# EAGLE design MOFO v1 (EAGLE 9.6.2)
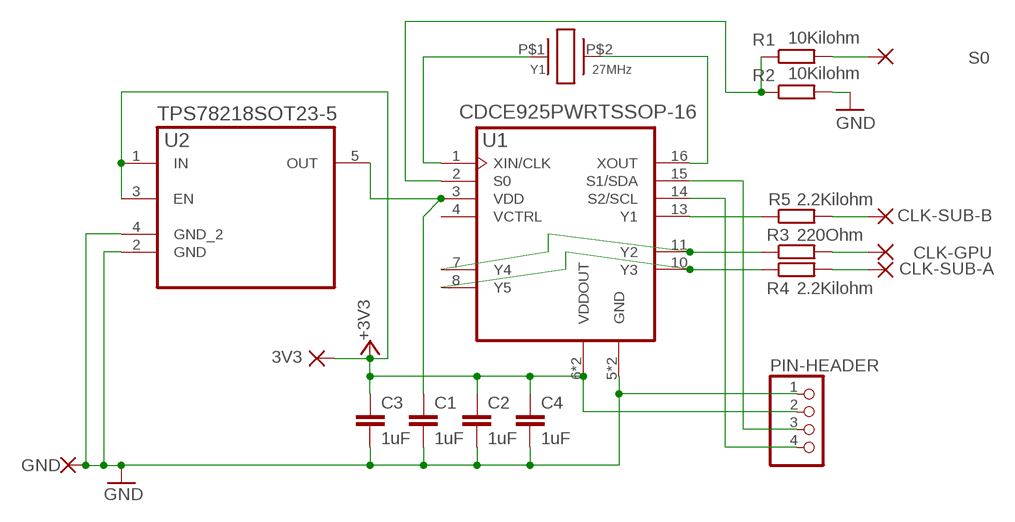
[diagram p0: schematic, sheet 1]

## Parts
3V3  PADSCIRCLE-1,5X1,5  [CIRCLE-1,5X1,5]
C1  1uF  CAPACITORSC0603  [C0603]
C2  1uF  CAPACITORSC0603  [C0603]
C3  1uF  CAPACITORSC0603  [C0603]
C4  1uF  CAPACITORSC0603  [C0603]
CLK-GPU  PADSCIRCLE-1,5X1,5  [CIRCLE-1,5X1,5]
CLK-SUB-A  PADSCIRCLE-1,5X1,5  [CIRCLE-1,5X1,5]
CLK-SUB-B  PADSCIRCLE-1,5X1,5  [CIRCLE-1,5X1,5]
GND  PADSCIRCLE-1,5X1,5  [CIRCLE-1,5X1,5]
PIN-HEADER  PIN-HEADER-1X4PH-1X04M  [PH-1X04M]
R1  10Kilohm  RESISTORSR0603  [R0603]
R2  10Kilohm  RESISTORSR0603  [R0603]
R3  220Ohm  RESISTORSR0603  [R0603]
R4  2.2Kilohm  RESISTORSR0603  [R0603]
R5  2.2Kilohm  RESISTORSR0603  [R0603]
S0  PADSCIRCLE-1,5X1,5  [CIRCLE-1,5X1,5]
U1  CDCE925PWRTSSOP-16  [TSSOP-16]
U2  TPS78218SOT23-5  [SOT23-5]
Y1  27MHz  ABM3ABM3  [ABM3]

## Nets
+1.8V: C1.1 U1.3(VDD) U2.5(OUT)
+3.3V: 3V3.1(P) C2.1 C3.1 C4.1 PIN-HEADER.2 U1.6(VDDOUT) U1.9(VDDOUT) U2.1(IN) U2.3(EN) ; supply symbol labelled +3V3
CLK-GPU-1: R3.1 U1.7(Y4) U1.11(Y2)
CLK-GPU-2: CLK-GPU.1(P) R3.2
CLK-SUB-A-1: R4.1 U1.8(Y5) U1.10(Y3)
CLK-SUB-A-2: CLK-SUB-A.1(P) R4.2
CLK-SUB-B-1: R5.1 U1.13(Y1)
CLK-SUB-B-2: CLK-SUB-B.1(P) R5.2
GND: C1.2 C2.2 C3.2 C4.2 GND.1(P) PIN-HEADER.1 R2.2 U1.5(GND) U1.12(GND) U2.2(GND) U2.4(GND_2)
S0-1: R1.1 R2.1 U1.2(S0)
S0-2: R1.2 S0.1(P)
SCL: PIN-HEADER.4 U1.14(S2/SCL)
SDA: PIN-HEADER.3 U1.15(S1/SDA)
X1: U1.1(XIN/CLK) Y1.P$1
X2: U1.16(XOUT) Y1.P$2
Unconnected: U1.4(VCTRL)

## Library data of the parts
3V3 CLK-GPU CLK-SUB-A CLK-SUB-B GND S0 = Consoles Unleashed Eagle Parts Library:PADS: PADS to connect wires to PCB
C1-C4 = Consoles Unleashed Eagle Parts Library:CAPACITORS: Capacitors
PIN-HEADER = Consoles Unleashed Eagle Parts Library:PIN-HEADER-1X4: Pin Header 1 x 4
R1-R5 = Consoles Unleashed Eagle Parts Library:RESISTORS: Resistors
U1 = Consoles Unleashed Eagle Parts Library:CDCE925PWR: CDCE925PWR
U2 = Consoles Unleashed Eagle Parts Library:TPS78218: Low-Dropout Linear Regulator
Y1 = Consoles Unleashed Eagle Parts Library:ABM3

## Board
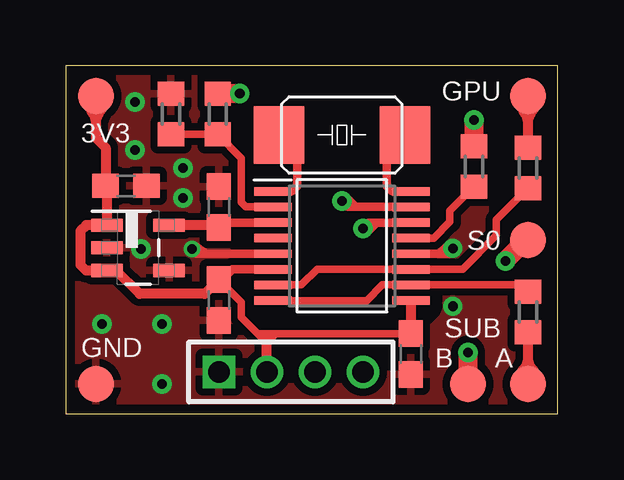
[diagram p1: board, top side]
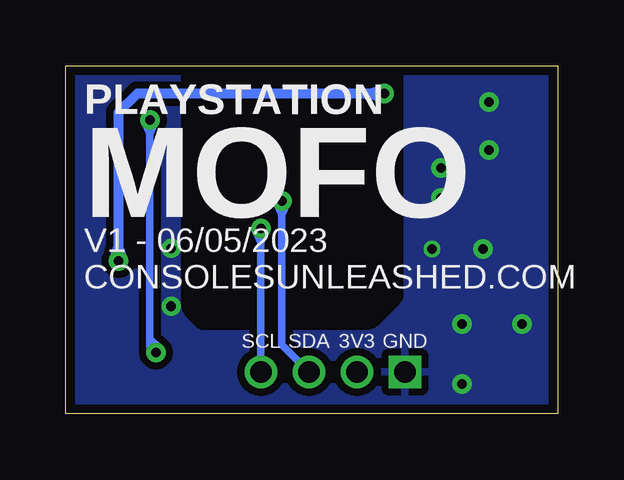
[diagram p2: board, bottom side, seen from below]

Size 20.5 x 14.5 mm. Coordinates in mm from the lower left corner, seen from the top.
Outline: 0,0 20.5,0 20.5,14.5 0,14.5 0,0
Copper layers (1*16): Top 0.035559375mm / dielectric 1.6mm / Bottom 0.035559375mm
Design rules "oshpark-2layer *": minimum track width 6mil, minimum drill 10mil, track to track 6mil, track to pad 6mil, pad to pad 6mil, via to via 6mil, smd to smd 6mil, copper to edge 15mil, drill to drill 6mil, minimum pad ring 5mil, minimum via ring 5mil, stop-mask expansion 2.5mil, vias tented up to drill 1mm, thermal gap 12mil

### Footprints (pad centres in the part's own frame; a part is rotated, then mirrored left to right if it is on the bottom)
CIRCLE-1,5X1,5 = smd 1.5 x 1.5: 1 0,0
C0603 = smd 1.1 x 1: 1 -0.85,0; 2 0.85,0
PH-1X04M = drill 0.914 square: 1 -3,0 | drill 0.914: 2 -1,0; 3 1,0; 4 3,0
R0603 = smd 1 x 1.1: 1 -0.85,0; 2 0.85,0
TSSOP-16 = smd 1.57 x 0.35: 1 -2.87,2.275; 2 -2.87,1.625; 3 -2.87,0.975; 4 -2.87,0.325; 5 -2.87,-0.325; 6 -2.87,-0.975; 7 -2.87,-1.625; 8 -2.87,-2.275; 9 2.87,-2.275; 10 2.87,-1.625; 11 2.87,-0.975; 12 2.87,-0.325; 13 2.87,0.325; 14 2.87,0.975; 15 2.87,1.625; 16 2.87,2.275
SOT23-5 = smd 1.321 x 0.559: 1 -1.295,0.94; 2 -1.295,0; 3 -1.295,-0.94; 4 1.295,-0.94; 5 1.295,0.94
ABM3 = smd 2.1 x 2.4: P$1 -2.631,0; P$2 2.631,0

### Placement (x,y rotation side)
3V3  1.25,13.25 0 top
C1  6.38,8.62 90 top
C2  6.38,4.75 270 top
C3  2.5,9.5 0 top
C4  14.38,2.5 270 top
CLK-GPU  19.25,13.25 0 top
CLK-SUB-A  19.25,1.25 0 top
CLK-SUB-B  16.75,1.25 0 top
GND  1.25,1.25 0 top
PIN-HEADER  9.38,1.75 0 top
R1  6.33,12.5 90 top
R2  4.38,12.5 90 top
R3  19.25,10.25 90 top
R4  19.25,4.25 270 top
R5  17,10.31 90 top
S0  19.25,7.25 0 top
U1  11.5,7 0 top
U2  3,6.92 0 top
Y1  11.5,11.62 0 top

### Tracks (layer width: path | path; a pad name or v marks a point on that pad's centre or on a via)
+1.8V
  Top 0.305: 6.58,7.97 C1.1 6.38,7.87
  Top 0.35: U1.3 6.58,7.97
  Top 0.406: 6.38,7.87 U2.5
+3.3V
  Top 0.305: C3.1 1.71,9.45 | U1.9 14.37,4.66 | C4.1 8.75,3.35 | C2.1 7.31,4.66 7.31,4.04 8,3.35 | 8.3,3.05 8.38,2.98 8.75,3.35 | 8.3,3.05 8,3.35 | 8.75,3.35 8.5,3.35 | 8.5,3.35 8,3.35 | 8.5,3.35 8.5,3.25 8.3,3.05 | 1.25,12.06 arc30 0.75,12.94 1.75,12.94 arc30 1.25,12.06
  Top 0.35: U1.6 6.92,6.03 6.5,5.6 C2.1
  Top 0.406: 3V3.1 1.25,12.06 1.25,11.5 1.65,11.1 C3.1 | 1.71,9.45 U2.1 0.84,7.87 0.6,7.62 0.6,6.21 0.83,5.99 U2.3 2.08,5.99 3.06,5 5.78,5 C2.1 | 14.37,4.66 C4.1 | PIN-HEADER.2 8.38,2.98
AVOID
  cutout Top: 6.88,14 6.88,4.31 7.69,3.5 14.94,3.5 15.48,4.04 arc45 15.69,4.54 15.69,5.31 14.5,6.5 14.5,14
AVOID1
  cutout Bottom: 6.44,14 6.44,4.97 arc45 6.59,4.59 7.47,3.72 arc45 8,3.5 14.75,3.5 arc45 15.07,3.63 15.48,4.05 arc45 15.69,4.54 15.69,14
CLK-GPU-1
  Top 0.305: R3.1 17.94,8.09 17.94,7.44 16.52,6.03 U1.11 10.46,6.03 9.81,5.38 U1.7
CLK-GPU-2
  Top 0.305: 19.25,12.06 arc30 18.75,12.94 19.75,12.94 arc30 19.25,12.06
  Top 0.406: CLK-GPU.1 19.25,12.06 R3.2
CLK-SUB-A-1
  Top 0.305: R4.1 19.25,5.38 U1.10 13.19,5.38 12.54,4.72 U1.8
CLK-SUB-A-2
  Top 0.305: 19.25,2.38 arc-30 18.75,1.56 19.75,1.56 arc-30 19.25,2.38
  Top 0.406: R4.2 19.25,2.38 CLK-SUB-A.1
CLK-SUB-B-1
  Top 0.305: U1.13 15.32,7.33 16,8 16,8.46 R5.1
CLK-SUB-B-2  (via drill 0.4 pad 0.8)
  Top 0.8: v17,12.25 R5.2 | v16.75,2.56 CLK-SUB-B.1
  Bottom 0.305: v17,12.25 17,2.81 v16.75,2.56 | v17,12.25 17.23,12.15 17,11.65 16.77,12.15 v17,12.25 | v16.75,2.56 16.59,2.75 17,3.11 17,2.56 v16.75,2.56
GND  (via drill 0.4 pad 0.7, 0.4 pad 0.8)
  Top 0.35: v16.12,6.9 15.89,6.67 U1.12 | 5.42,6.67 U1.5 | v16.12,6.9 16.12,6.67 15.56,6.67 15.96,7.06 v16.12,6.9 | v5.25,6.88 5.35,7.02 5.82,6.67 5.24,6.7 v5.25,6.88
  Top 0.406: v5.25,6.88 5.33,7
  other vias: 3.12,6.88 1.5,3.75 4,1.25 2.88,13 4,3.75 4.88,9 4.88,10.25 16.12,4.49 2.88,11
  pour Top (isolate 0.305): 0,14.5 20.5,14.5 20.5,0 0,0
  pour Bottom (isolate 0.305): 0,14.5 20.5,14.5 20.5,0 0,0
S0-1
  Top 0.305: U1.2 7.5,8.62 7.31,8.81 7.31,10.66 R1.1 R2.1
S0-2  (via drill 0.4 pad 0.8)
  Top 0.8: v7.24,13.35 R1.2 | S0.1 19.19,7.25 v18.31,6.38
  Bottom 0.406: v7.24,13.35 17.52,13.35 18.31,12.56 v18.31,6.38 | v7.24,13.35 7.3,13.54 7.84,13.35 7.3,13.16 v7.24,13.35 | v18.31,6.38 18.13,6.44 18.31,6.97 18.5,6.44 v18.31,6.38
SCL  (via drill 0.4 pad 0.8)
  Top 0.35: U1.14 12.62,7.97 v12.38,7.72 | v12.38,7.72 12.37,7.95 12.92,7.97 12.54,7.57 v12.38,7.72
  Bottom 0.305: PIN-HEADER.4 v12.38,7.72 | v12.38,7.72 12.6,7.62 12.38,7.12 12.15,7.62 v12.38,7.72
SDA  (via drill 0.4 pad 0.8)
  Top 0.35: U1.15 11.75,8.62 v11.5,8.88 | v11.5,8.88 11.66,9.03 12.04,8.62 11.49,8.65 v11.5,8.88
  Bottom 0.305: v11.5,8.88 11.5,2.88 PIN-HEADER.3 | v11.5,8.88 11.73,8.77 11.5,8.28 11.27,8.77 v11.5,8.88
X1
  Top 0.35: Y1.P$1 9.63,10.86 9.63,9.51 9.4,9.28 U1.1
X2
  Top 0.35: U1.16 13.6,9.28 13.37,9.51 13.37,10.86 Y1.P$2

### Text on the board
tNames: GPU | 3V3 | S0 | SUB | B | A | GND
bNames: PLAYSTATION | MOFO | V1 - 06/05/2023 / CONSOLESUNLEASHED.COM | GND | 3V3 | SDA | SCL